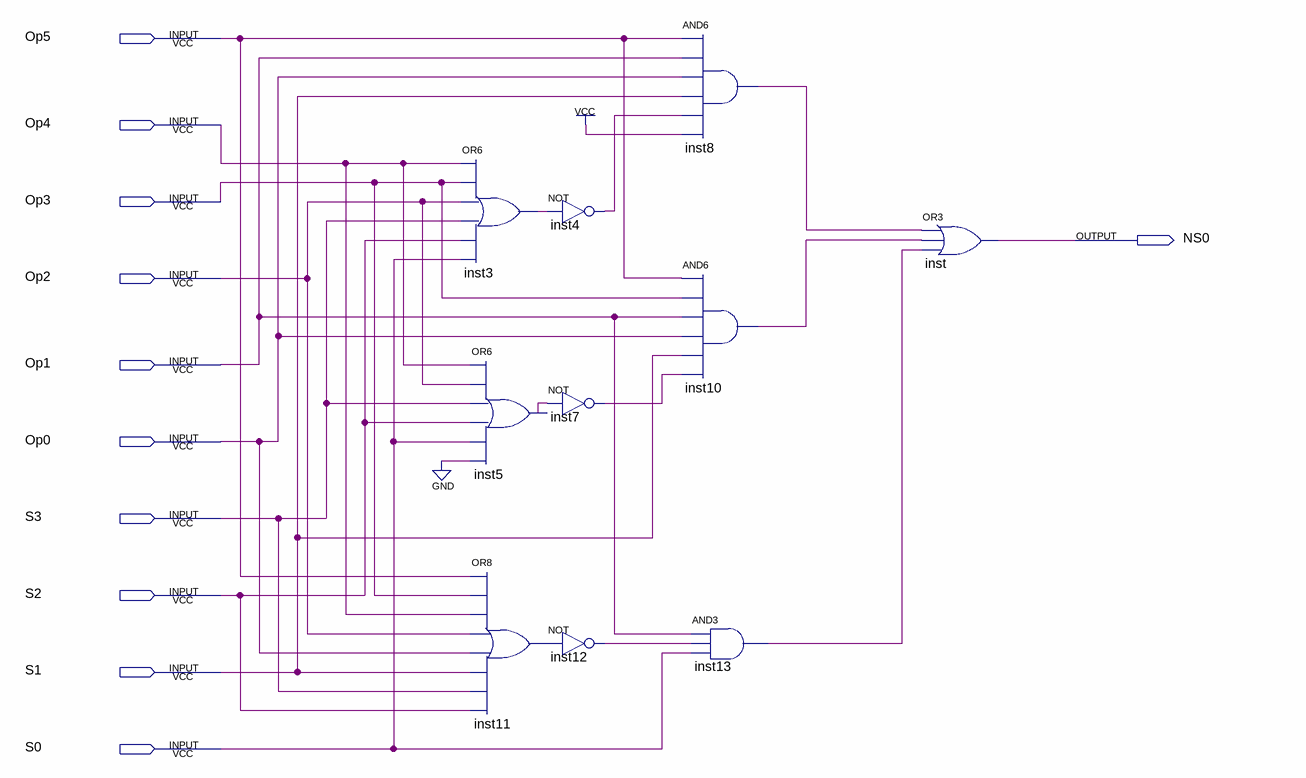
[diagram p0: schematic sheet]
// Quartus schematic NS0.bdf as structural Verilog: 10 symbols, 11 pins
module NS0 (
  input  Op5,
  input  Op4,
  input  Op3,
  input  Op2,
  input  Op1,
  input  Op0,
  input  S3,
  input  S2,
  input  S1,
  input  S0,
  output NS0
);

  wire inst3_out, inst4_out, inst5_out, inst7_out, inst8_out, inst10_out, inst11_out, inst12_out, inst13_out;

  or inst3 (inst3_out, Op4, Op3, Op2, S3, S2, S0);
  or inst5 (inst5_out, Op4, Op2, S3, S2, S0, 1'b0);
  or inst11 (inst11_out, Op5, Op3, Op4, Op2, Op0, S1, S3, S2);
  not inst4 (inst4_out, inst3_out);
  not inst7 (inst7_out, inst5_out);
  not inst12 (inst12_out, inst11_out);
  and inst8 (inst8_out, Op5, Op1, Op0, S1, inst4_out, 1'b1);
  and inst10 (inst10_out, Op5, Op3, Op1, Op0, S1, inst7_out);
  and inst13 (inst13_out, Op1, inst12_out, S0);
  or inst (NS0, inst8_out, inst10_out, inst13_out);
endmodule
